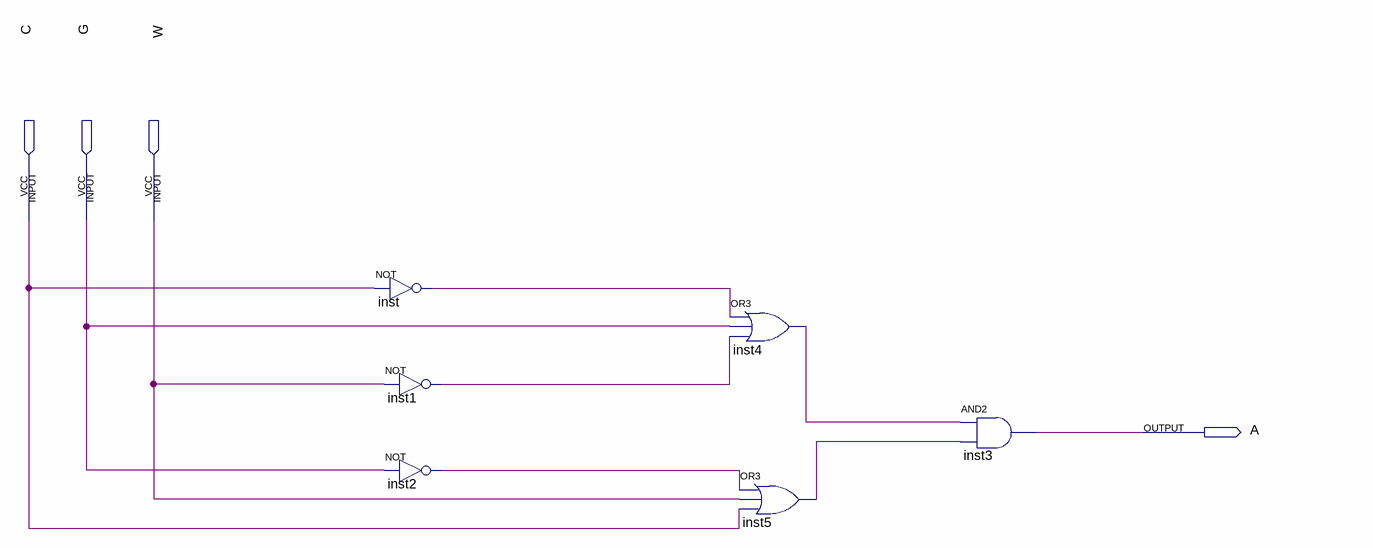
[diagram p0: schematic sheet]
// Quartus schematic lab3step0_new.bdf as structural Verilog: 6 symbols, 4 pins
module lab3step0_new (
  input  C,
  input  G,
  input  W,
  output A
);

  wire inst1_out, inst2_out, inst4_out, inst5_out, inst_out;

  not inst (inst_out, C);
  not inst1 (inst1_out, W);
  not inst2 (inst2_out, G);
  or inst4 (inst4_out, inst_out, G, inst1_out);
  or inst5 (inst5_out, inst2_out, W, C);
  and inst3 (A, inst4_out, inst5_out);
endmodule
